# EAGLE design simple-blinker-schematic (EAGLE 9.2.2)
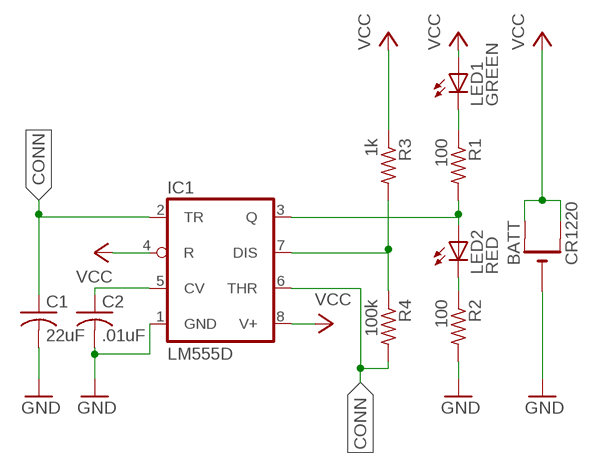
[diagram p0: schematic, sheet 1]

## Parts
BATT  CR1220  CR1220SMT  [CR1220-SMD]
C1  22uF  C-USC0805  [C0805]
C2  .01uF  C-USC0805  [C0805]
IC1  LM555D  [SO08]
LED1  GREEN  LEDCHIPLED_0805  [CHIPLED_0805]
LED2  RED  LEDCHIPLED_0805  [CHIPLED_0805]
R1  100  R-US_R0805  [R0805]
R2  100  R-US_R0805  [R0805]
R3  1k  R-US_R0805  [R0805]
R4  100k  R-US_R0805  [R0805]

## Nets
CONN: C1.1 IC1.2(TR) IC1.6(THR) R4.2
GND: BATT.- C1.2 C2.2 IC1.1(GND) R2.2
N$1: LED1.C R1.1
N$2: IC1.3(Q) LED2.A R1.2
N$3: LED2.C R2.1
N$4: IC1.7(DIS) R3.2 R4.1
N$5: C2.1 IC1.5(CV)
VCC: BATT.+$1(+) BATT.+$2(+1) IC1.4(R) IC1.8(V+) LED1.A R3.1

## Library data of the parts
BATT = adafruit:CR1220: CR1216/CR1220/CR1225 12mm 3V lithium coin cell Great for battery packup. Both SMT and THM holders. Note the THM package has the ground pads on both sides of the PCB so that the masks are the same - this reduces the cost; OC_NEWARK: unknown
C1 = rcl:C-US: CAPACITOR, American symbol; MF: VISHAY/SPRAGUE; MPN: 293D226X9016B2TE3; OC_NEWARK: 09K6241; SPICEPREFIX: C
C2 = rcl:C-US: CAPACITOR, American symbol; MPN: SR211C103KAA.; OC_NEWARK: 82AC0070; SPICEPREFIX: C
IC1 = adafruit:*555: TIMER Changed DIP package to have round (not oval) pin pads http://www.ladyada.net/library/pcb/eaglelibrary.html; OC_NEWARK: unknown
LED1 LED2 = adafruit:LED: LED OSRAM: - CHIPLED LG R971, LG N971, LY N971, LG Q971, LY Q971, LO R971, LY R971 LH N974, LH R974 LS Q976, LO Q976, LY Q976 LO Q996 - Hyper CHIPLED LW Q18S LB Q993, LB Q99A, LB R99A - SideLED LS A670, LO A670, LY A670, LG A670, LP A670 LB A673, LV A673, LT A673, LW A673 LH A674 LY A675 LS A676, LA A676, LO A676, LY A676, LW A676 LS A679, LY A679, LG A679 - Hyper Micro SIDELED® LS Y876, LA Y876, LO Y876, LY Y876 LT Y87S - SmartLED LW L88C, LW L88S LB L89C, LB L89S, LG L890 LS L89K, LO L89K, LY L89K LS L896, LA L896, LO L896, LY L896 - TOPLED LS T670, LO T670, LY T670, LG T670, LP T670 LSG T670, LSP T670, LSY T670, LOP T670, LYG T670 LG T671, LOG T671, LSG T671 LB T673, LV T673, LT T673, LW T673 LH T674 LS T676, LA T676, LO T676, LY T676, LB T676, LH T676, LSB T676, LW T676 LB T67C, LV T67C, LT T67C, LS T67K, LO T67K, LY T67K, LW E67C LS E67B, LA E67B, LO E67B, LY E67B, LB E67C, LV E67C, LT E67C LW T67C LS T679, LY T679, LG T679 LS T770, LO T770, LY T770, LG T770, LP T770 LB T773, LV T773, LT T773, LW T773 LH T774 LS E675, LA E675, LY E675, LS T675 LS T776, LA T776, LO T776, LY T776, LB T776 LHGB T686 LT T68C, LB T68C - Hyper Mini TOPLED® LB M676 - Mini TOPLED Santana® LG M470 LS M47K, LO M47K, LY M47K Source: http://www.osram.convergy.de/; OC_NEWARK: unknown
R1 R2 = rcl:R-US_: RESISTOR, American symbol; MF: VISHAY/DALE; MPN: CRCW1206100RFKTA; OC_NEWARK: 05F1528; SPICEPREFIX: R
R3 = rcl:R-US_: RESISTOR, American symbol; MPN: CRCW08051K00FKEB; OC_NEWARK: 26R4044; SPICEPREFIX: R
R4 = rcl:R-US_: RESISTOR, American symbol; MF: VISHAY/DALE; MPN: TNPW0805100KBEEA; OC_NEWARK: 27K5900; SPICEPREFIX: R

## Board
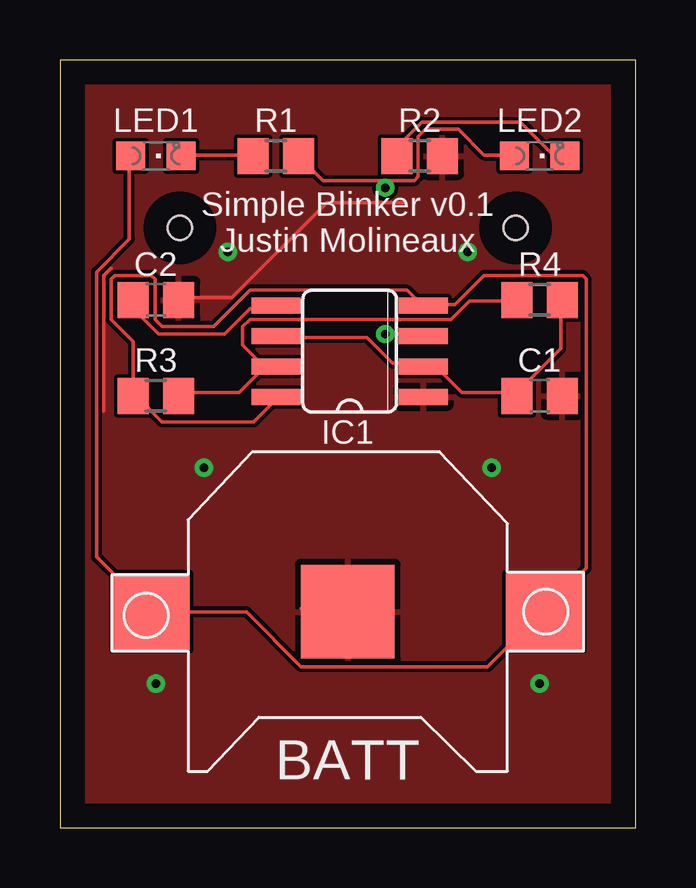
[diagram p1: board, top side]
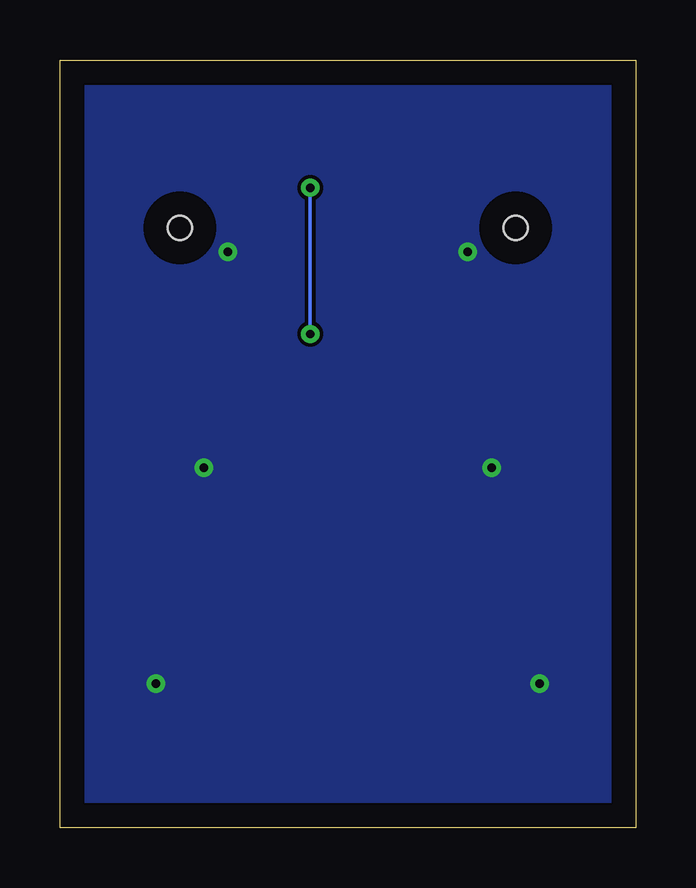
[diagram p2: board, bottom side, seen from below]

Size 24 x 32 mm. Coordinates in mm from the lower left corner, seen from the top.
Outline: 0,0 24,0 24,32 0,32 0,0
Copper layers (1*16): Top 0.035mm / dielectric 1.5mm / Bottom 0.035mm
Design rules "default": minimum track width 6mil, minimum drill 0.35mm, track to track 6mil, track to pad 6mil, pad to pad 6mil, via to via 6mil, smd to smd 6mil, copper to edge 40mil, drill to drill 6mil, minimum pad ring 10mil, minimum via ring 8mil, stop-mask expansion 4mil, vias tented up to drill 0mil, thermal gap 10mil
Holes 1 mm at 5,25 19,25

### Footprints (pad centres in the part's own frame; a part is rotated, then mirrored left to right if it is on the bottom)
CR1220-SMD = smd 3.2 x 3.2: +$1 -8.2,0; +$2 8.2,0 | smd 3.9 x 3.9: - 0,0
C0805 = smd 1.3 x 1.5: 1 -0.95,0; 2 0.95,0
SO08 = smd 0.66 x 2.032: 1 -1.905,-3.073; 2 -0.635,-3.073; 3 0.635,-3.073; 4 1.905,-3.073; 5 1.905,3.073; 6 0.635,3.073; 7 -0.635,3.073; 8 -1.905,3.073
CHIPLED_0805 = smd 1.2 x 1.2: A 0,-1.05; C 0,1.05
R0805 = smd 1.3 x 1.5: 1 -0.95,0; 2 0.95,0

### Placement (x,y rotation side)
BATT  12,9 180 top
C1  20,18 0 top
C2  4,22 0 top
IC1  12.08,19.86 90 top
LED1  4,28 270 top
LED2  20,28 270 top
R1  9,28 0 top
R2  15,28 0 top
R3  4,18 0 top
R4  20,22 0 top

### Tracks (layer width: path | path; a pad name or v marks a point on that pad's centre or on a via)
CONN
  Top 0.152: 19.05,18.14 16.76,18.14 15.7,19.2 15.24,19.2 IC1.2 15.09,19.36 13.87,19.36 12.8,20.42 9.14,20.42 IC1.6 | 19.05,18.14 20.88,19.96 20.88,21.95 R4.2 | 19.05,18.14 C1.1
GND  (via drill 0.35)
  Top 0.152: 14.33,26.06 11.12,26.06 7.16,22.1 5.03,22.1 C2.2 | 15.85,27.58 15.85,27.89 R2.2 | 20.88,17.98 C1.2 | 15.24,17.83 IC1.1 | 2.13,23.32 1.83,23.01 1.83,17.37 | 10.06,9.14 11.89,9.14 BATT.-
  other vias: 6,15 18,15 4,6 20,6 17,24 7,24
  pour Top: -1,-1 25,-1 25,33 -1,33
  pour Bottom: -1,-1 25,-1 25,33 -1,33
N$1
  Top 0.152: LED1.C 5.18,28.04 7.92,28.04 R1.1
N$2  (via drill 0.35)
  Top 0.152: 13.56,26.98 10.97,26.98 10.06,27.89 R1.2 | 13.56,26.98 14.78,26.98 14.94,27.13 14.94,28.8 15.24,29.11 16.61,29.11 17.68,28.04 18.9,28.04 LED2.A | v13.56,20.57 15.09,20.57 IC1.3 | 13.56,26.98 v13.56,26.67
  Bottom 0.152: v13.56,26.67 v13.56,20.57
N$3
  Top 0.152: LED2.C 21.03,28.04 20.57,28.04 19.2,29.41 15.09,29.41 14.17,28.5 14.17,28.04 R2.1
N$4
  Top 0.152: 8.53,19.2 7.47,18.14 5.03,18.14 R3.2 | 8.53,19.2 8.99,19.2 IC1.7 8.53,19.2 | 8.53,19.2 7.62,20.12 7.62,20.88 7.92,21.18 16.31,21.18 17.07,21.95 19.05,21.95 R4.1
N$5
  Top 0.152: C2.1 3.2,21.95 3.2,21.49 4.12,20.57 6.86,20.57 7.92,21.64 8.99,21.64 IC1.5
VCC
  Top 0.152: LED1.A 2.9,27.89 2.9,24.54 1.52,23.16 1.52,11.28 3.66,9.14 BATT.+$2 7.77,8.99 10.06,6.71 17.83,6.71 20.12,8.99 BATT.+$1 20.27,9.14 21.95,10.82 21.95,22.86 21.79,23.01 17.68,23.01 16.46,21.79 15.24,21.79 IC1.4 15.09,21.79 14.48,22.4 7.92,22.4 6.4,20.88 4.27,20.88 3.96,21.18 3.96,22.86 3.81,23.01 2.29,23.01 2.13,22.86 2.13,21.18 3.05,20.27 3.05,18.14 R3.1 3.2,17.98 4.27,16.92 8.08,16.92 8.99,17.83 IC1.8

### Text on the board
tNames: Simple Blinker v0.1 / Justin Molineaux